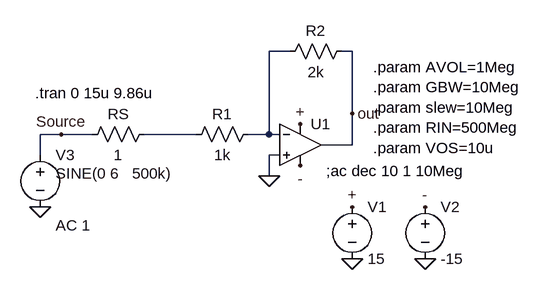
[diagram p0: schematic universalopamp.asc]
universalopamp.asc, the LTspice schematic file:
Version 4
SHEET 1 880 680
WIRE 48 0 16 0
WIRE 144 0 128 0
WIRE 144 96 144 0
WIRE -304 128 -336 128
WIRE -256 128 -304 128
WIRE -96 128 -176 128
WIRE 16 128 16 0
WIRE 16 128 -16 128
WIRE 32 128 16 128
WIRE 144 144 144 96
WIRE 144 144 96 144
WIRE -336 160 -336 128
WIRE 32 160 16 160
WIRE 16 192 16 160
FLAG 256 320 0
FLAG 144 320 0
FLAG 64 112 +
FLAG 144 240 +
FLAG 256 240 -
FLAG 64 176 -
FLAG 144 96 out
FLAG -336 240 0
FLAG -304 128 Source
FLAG 16 192 0
SYMBOL Opamps\\UniversalOpamp2 64 144 R0
SYMATTR InstName U1
SYMATTR Value2 Avol={AVOL} GBW={GBW} Slew={SLEW}
SYMATTR SpiceLine ilimit=25m rail=0 Vos={VOS} phimargin=45
SYMATTR SpiceLine2 en=0 enk=0 in=0 ink=0 Rin={RIN}
SYMBOL voltage 144 224 R0
WINDOW 123 0 0 Left 2
WINDOW 39 0 0 Left 2
SYMATTR InstName V1
SYMATTR Value 15
SYMBOL voltage 256 224 R0
WINDOW 123 0 0 Left 2
WINDOW 39 0 0 Left 2
SYMATTR InstName V2
SYMATTR Value -15
SYMBOL res 0 112 R90
WINDOW 0 0 56 VBottom 2
WINDOW 3 32 56 VTop 2
SYMATTR InstName R1
SYMATTR Value 1k
SYMBOL voltage -336 144 R0
WINDOW 123 24 124 Left 2
WINDOW 39 0 0 Left 2
WINDOW 3 24 44 Left 2
SYMATTR Value2 AC 1
SYMATTR Value SINE(0 6   500k)
SYMATTR InstName V3
SYMBOL res -160 112 R90
WINDOW 0 0 56 VBottom 2
WINDOW 3 32 56 VTop 2
SYMATTR InstName RS
SYMATTR Value 1
SYMBOL res 144 -16 R90
WINDOW 0 0 56 VBottom 2
WINDOW 3 32 56 VTop 2
SYMATTR InstName R2
SYMATTR Value 2k
TEXT 104 184 Left 2 !;ac dec 10 1 10Meg
TEXT 176 24 Left 2 !.param AVOL=1Meg\n.param GBW=10Meg\n.param slew=10Meg\n.param RIN=500Meg\n.param VOS=10u
TEXT -344 64 Left 2 !.tran 0 15u 9.86u

The netlist it stands for:
* universalopamp.asc
XU1 0 N001 + - out level.2 Avol={AVOL} GBW={GBW} Slew={SLEW} ilimit=25m rail=0 Vos={VOS} phimargin=45 en=0 enk=0 in=0 ink=0 Rin={RIN}  ; pins IN+ IN- V+ V- OUT
V1 + 0 15
V2 - 0 -15
R1 N001 N002 1k
V3 Source 0 SINE(0 6   500k) AC 1
RS N002 Source 1
R2 out N001 2k
;ac dec 10 1 10Meg
.param AVOL=1Meg
.param GBW=10Meg
.param slew=10Meg
.param RIN=500Meg
.param VOS=10u
.tran 0 15u 9.86u
.lib UniversalOpamps2.sub
.backanno
.end